# Altium schematic sheet SDIO_WIFI.SchDoc
size A4
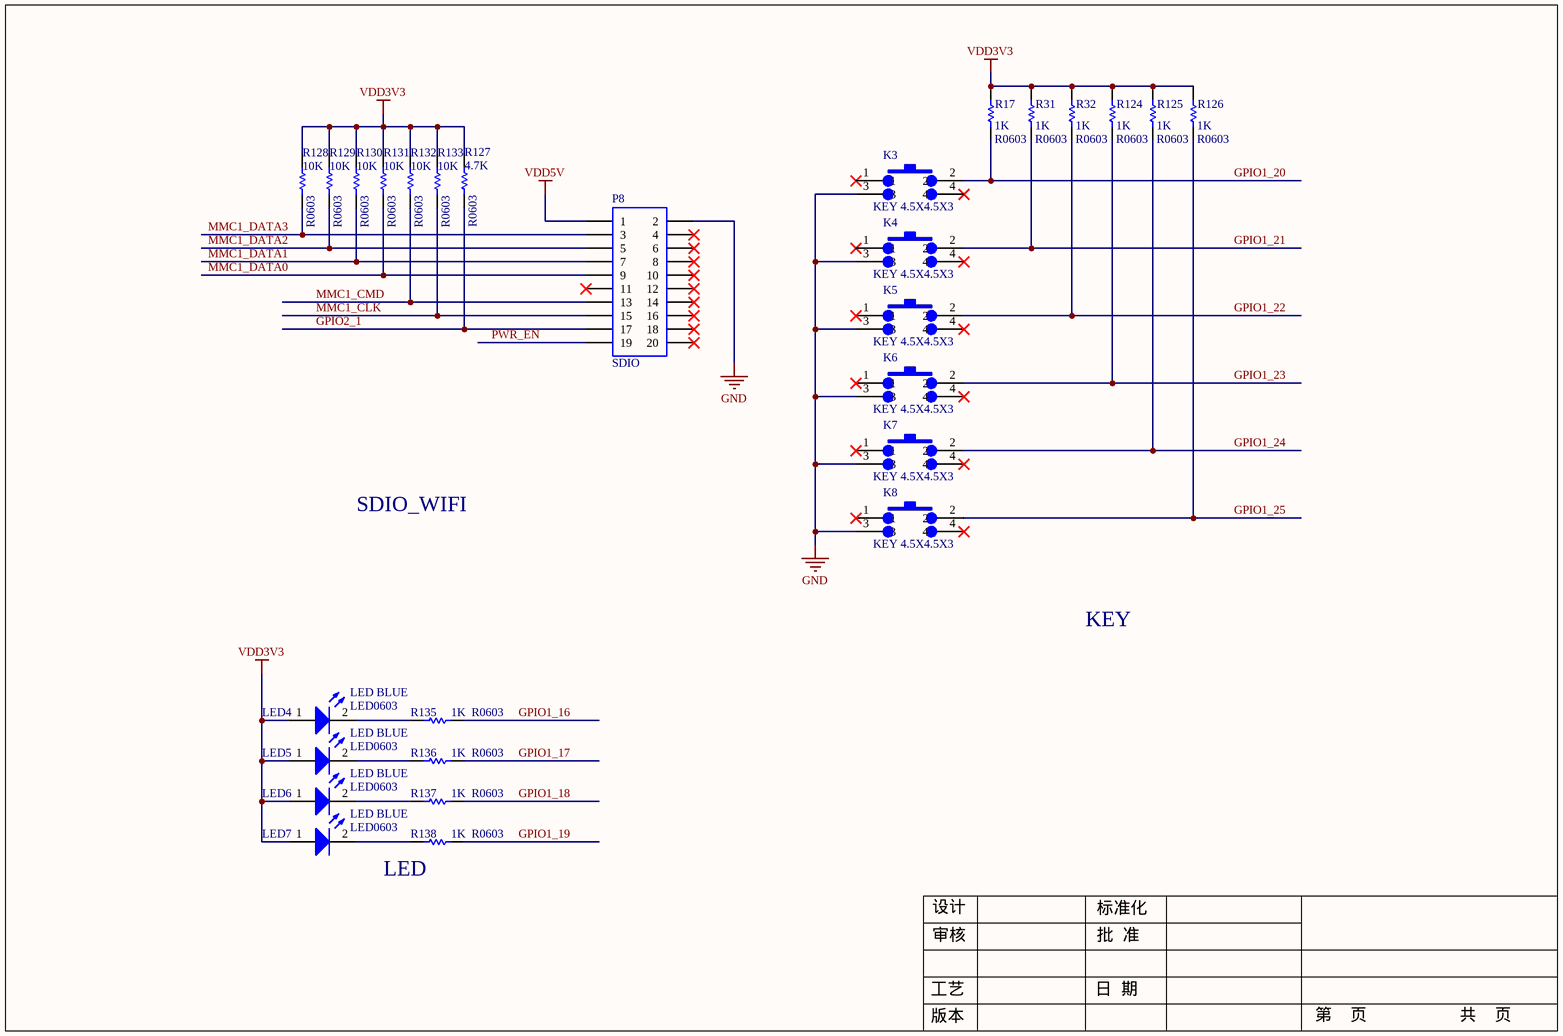
[diagram p0: SDIO_WIFI.SchDoc]

## Parts
K3  KEY 4.5X4.5X3  [SWPB-4]
K4  KEY 4.5X4.5X3  [SWPB-4]
K5  KEY 4.5X4.5X3  [SWPB-4]
K6  KEY 4.5X4.5X3  [SWPB-4]
K7  KEY 4.5X4.5X3  [SWPB-4]
K8  KEY 4.5X4.5X3  [SWPB-4]
LED4  LED BLUE  value LED0603  [LED0603_M1608]
LED5  LED BLUE  value LED0603  [LED0603_M1608]
LED6  LED BLUE  value LED0603  [LED0603_M1608]
LED7  LED BLUE  value LED0603  [LED0603_M1608]
P8  SDIO  [IDC20S]
R17  1K  value R0603  [R0603_M1608]
R31  1K  value R0603  [R0603_M1608]
R32  1K  value R0603  [R0603_M1608]
R124  1K  value R0603  [R0603_M1608]
R125  1K  value R0603  [R0603_M1608]
R126  1K  value R0603  [R0603_M1608]
R127  4.7K  value R0603  [R0603_M1608]
R128  10K  value R0603  [R0603_M1608]
R129  10K  value R0603  [R0603_M1608]
R130  10K  value R0603  [R0603_M1608]
R131  10K  value R0603  [R0603_M1608]
R132  10K  value R0603  [R0603_M1608]
R133  10K  value R0603  [R0603_M1608]
R135  1K  value R0603  [R0603_M1608]
R136  1K  value R0603  [R0603_M1608]
R137  1K  value R0603  [R0603_M1608]
R138  1K  value R0603  [R0603_M1608]

## Nets
GND: K3.3 K4.3 K5.3 K6.3 K7.3 K8.3 P8.2
VDD3V3: LED4.1(A) LED5.1(A) LED6.1(A) LED7.1(A) R17.1 R31.1 R32.1 R124.1 R125.1 R126.1 R127.1 R128.1 R129.1 R130.1 R131.1 R132.1 R133.1
VDD5V: P8.1
GPIO1_16: R135.2
GPIO1_17: R136.2
GPIO1_18: R137.2
GPIO1_19: R138.2
GPIO1_20: K3.2 R17.2
GPIO1_21: K4.2 R31.2
GPIO1_22: K5.2 R32.2
GPIO1_23: K6.2 R124.2
GPIO1_24: K7.2 R125.2
GPIO1_25: K8.2 R126.2
GPIO2_1: P8.17 R127.2
MMC1_CLK: P8.15 R133.2
MMC1_CMD: P8.13 R132.2
MMC1_DATA0: P8.9 R131.2
MMC1_DATA1: P8.7 R130.2
MMC1_DATA2: P8.5 R129.2
MMC1_DATA3: P8.3 R128.2
PWR_EN: P8.19
NetLED4_2: LED4.2(K) R135.1
NetLED5_2: LED5.2(K) R136.1
NetLED6_2: LED6.2(K) R137.1
NetLED7_2: LED7.2(K) R138.1

Not connected (* = marked no-connect by the designer): K3 1* 4*; K4 1* 4*; K5 1* 4*; K6 1* 4*; K7 1* 4*; K8 1* 4*; P8 4* 6* 8* 10* 11* 12* 14* 16* 18* 20*

## Notes on the sheet
- SDIO_WIFI
- KEY
- (near R138) LED
- 设计
- 标准化
- 审核
- 批  准
- 版本
- 工艺
- 日  期
- 第    页
- 共    页

## Library data of the parts
LED4-LED7 = LED2: Typical RED, GREEN, YELLOW, AMBER GaAs LED; Published: 8-Jun-2000; LatestRevisionDate: 17-Jul-2002; LatestRevisionNote: Re-released for DXP Platform.; PackageVersion: Feb-2002; PackageReference: 3.2X1.6X1.1; Publisher: Altium Limited; PackageDescription: SM LED; 2 Flat Leads
P8 = Header 10X2: Header, 10-Pin, Dual row; LatestRevisionDate: 17-Jul-2002; LatestRevisionNote: Re-released for DXP Platform.; Publisher: Altium Limited
R17 R31 R32 R124-R126 R135-R138 = Res1: R0603; Published: 8-Jun-2000; LatestRevisionDate: 17-Jul-2002; LatestRevisionNote: Re-released for DXP Platform.; PackageReference: AXIAL-0.3; Publisher: Altium Limited; PackageDescription: Axial Device, Thru-Hole; 2 Leads; 0.3 in Pin Spacing
R127-R133 = Res1: Resistor; Published: 8-Jun-2000; LatestRevisionDate: 17-Jul-2002; LatestRevisionNote: Re-released for DXP Platform.; PackageReference: AXIAL-0.3; Publisher: Altium Limited; PackageDescription: Axial Device, Thru-Hole; 2 Leads; 0.3 in Pin Spacing